# EAGLE schematic 24S Sensor Schematic v9 (EAGLE 9.7.0)
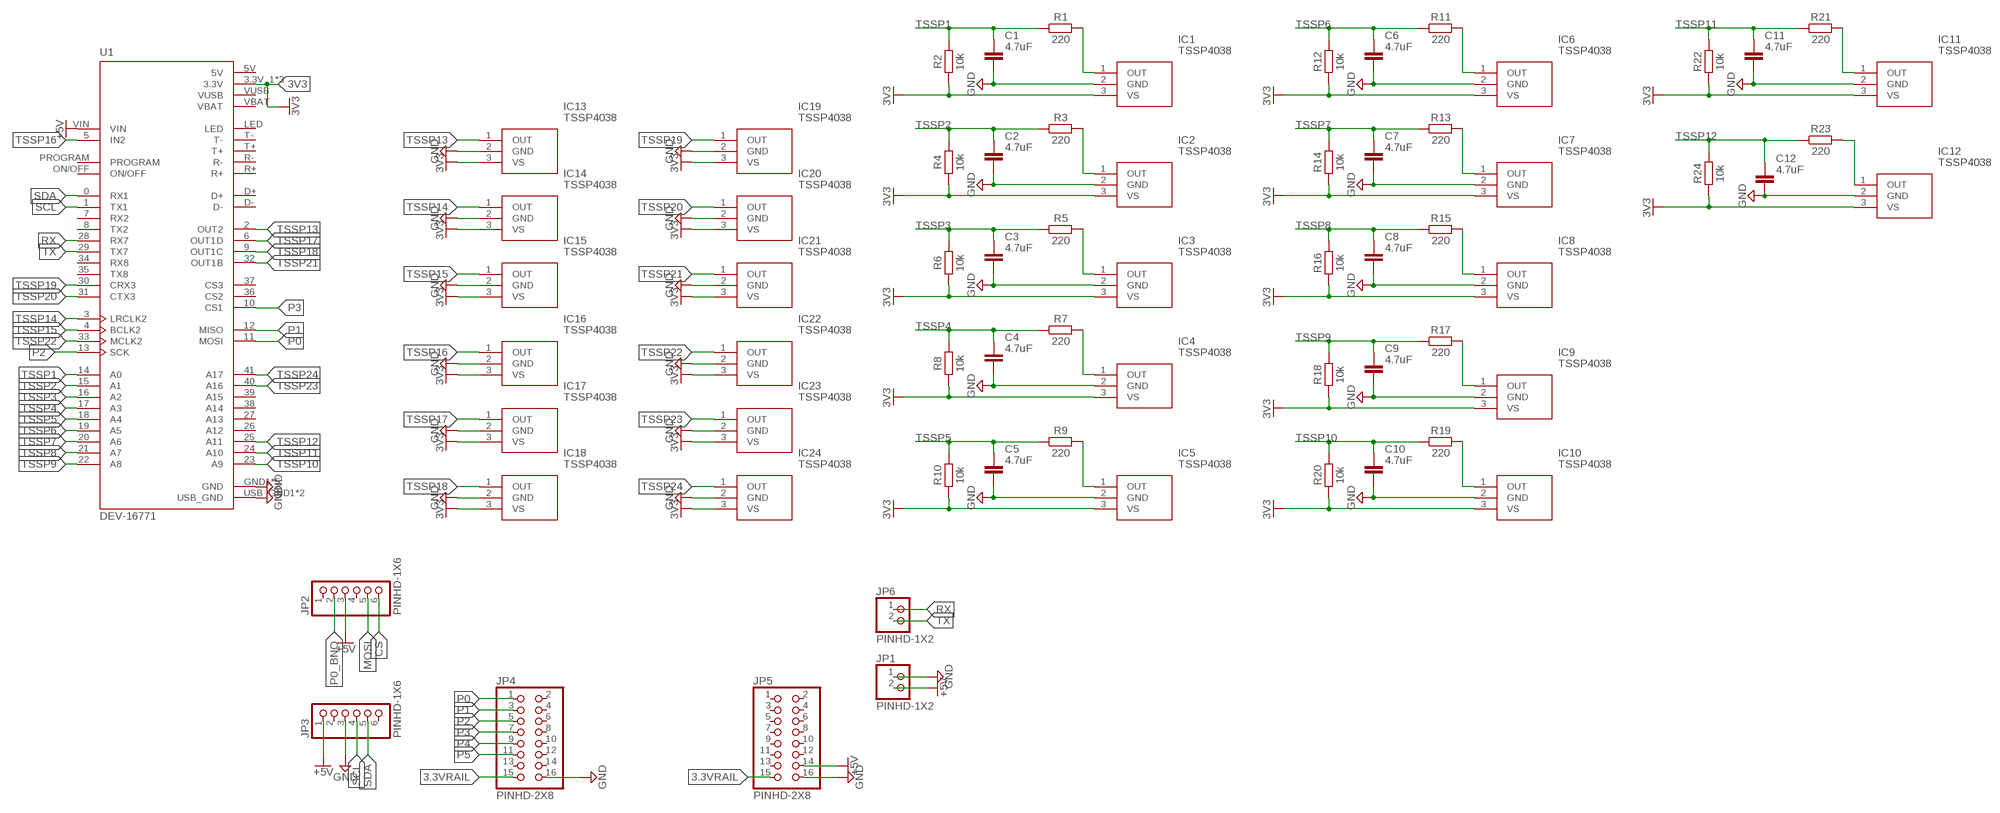
[diagram p0: schematic, sheet 1]

## Parts
C1  4.7uF  C_CHIP-1206(3216-METRIC)  [CAPC3216X135]
C2  4.7uF  C_CHIP-1206(3216-METRIC)  [CAPC3216X135]
C3  4.7uF  C_CHIP-1206(3216-METRIC)  [CAPC3216X135]
C4  4.7uF  C_CHIP-1206(3216-METRIC)  [CAPC3216X135]
C5  4.7uF  C_CHIP-1206(3216-METRIC)  [CAPC3216X135]
C6  4.7uF  C_CHIP-1206(3216-METRIC)  [CAPC3216X135]
C7  4.7uF  C_CHIP-1206(3216-METRIC)  [CAPC3216X135]
C8  4.7uF  C_CHIP-1206(3216-METRIC)  [CAPC3216X135]
C9  4.7uF  C_CHIP-1206(3216-METRIC)  [CAPC3216X135]
C10  4.7uF  C_CHIP-1206(3216-METRIC)  [CAPC3216X135]
C11  4.7uF  C_CHIP-1206(3216-METRIC)  [CAPC3216X135]
C12  4.7uF  C_CHIP-1206(3216-METRIC)  [CAPC3216X135]
IC1  TSSP4038  [TSSP4038]
IC2  TSSP4038  [TSSP4038]
IC3  TSSP4038  [TSSP4038]
IC4  TSSP4038  [TSSP4038]
IC5  TSSP4038  [TSSP4038]
IC6  TSSP4038  [TSSP4038]
IC7  TSSP4038  [TSSP4038]
IC8  TSSP4038  [TSSP4038]
IC9  TSSP4038  [TSSP4038]
IC10  TSSP4038  [TSSP4038]
IC11  TSSP4038  [TSSP4038]
IC12  TSSP4038  [TSSP4038]
IC13  TSSP4038  [TSSP4038]
IC14  TSSP4038  [TSSP4038]
IC15  TSSP4038  [TSSP4038]
IC16  TSSP4038  [TSSP4038]
IC17  TSSP4038  [TSSP4038]
IC18  TSSP4038  [TSSP4038]
IC19  TSSP4038  [TSSP4038]
IC20  TSSP4038  [TSSP4038]
IC21  TSSP4038  [TSSP4038]
IC22  TSSP4038  [TSSP4038]
IC23  TSSP4038  [TSSP4038]
IC24  TSSP4038  [TSSP4038]
JP1  PINHD-1X2  [1X02]
JP2  PINHD-1X6  [1X06]
JP3  PINHD-1X6  [1X06]
JP4  PINHD-2X8  [2X08]
JP5  PINHD-2X8  [2X08]
JP6  PINHD-1X2  [1X02]
R1  220  R_CHIP-1206(3216-METRIC)  [RESC3216X70]
R2  10k  R_CHIP-1206(3216-METRIC)  [RESC3216X70]
R3  220  R_CHIP-1206(3216-METRIC)  [RESC3216X70]
R4  10k  R_CHIP-1206(3216-METRIC)  [RESC3216X70]
R5  220  R_CHIP-1206(3216-METRIC)  [RESC3216X70]
R6  10k  R_CHIP-1206(3216-METRIC)  [RESC3216X70]
R7  220  R_CHIP-1206(3216-METRIC)  [RESC3216X70]
R8  10k  R_CHIP-1206(3216-METRIC)  [RESC3216X70]
R9  220  R_CHIP-1206(3216-METRIC)  [RESC3216X70]
R10  10k  R_CHIP-1206(3216-METRIC)  [RESC3216X70]
R11  220  R_CHIP-1206(3216-METRIC)  [RESC3216X70]
R12  10k  R_CHIP-1206(3216-METRIC)  [RESC3216X70]
R13  220  R_CHIP-1206(3216-METRIC)  [RESC3216X70]
R14  10k  R_CHIP-1206(3216-METRIC)  [RESC3216X70]
R15  220  R_CHIP-1206(3216-METRIC)  [RESC3216X70]
R16  10k  R_CHIP-1206(3216-METRIC)  [RESC3216X70]
R17  220  R_CHIP-1206(3216-METRIC)  [RESC3216X70]
R18  10k  R_CHIP-1206(3216-METRIC)  [RESC3216X70]
R19  220  R_CHIP-1206(3216-METRIC)  [RESC3216X70]
R20  10k  R_CHIP-1206(3216-METRIC)  [RESC3216X70]
R21  220  R_CHIP-1206(3216-METRIC)  [RESC3216X70]
R22  10k  R_CHIP-1206(3216-METRIC)  [RESC3216X70]
R23  220  R_CHIP-1206(3216-METRIC)  [RESC3216X70]
R24  10k  R_CHIP-1206(3216-METRIC)  [RESC3216X70]
U1  DEV-16771  [MODULE_DEV-16771]

## Nets
3.3VRAIL: JP4.15 JP5.15
3V3: IC1.3(VS) IC2.3(VS) IC3.3(VS) IC4.3(VS) IC5.3(VS) IC6.3(VS) IC7.3(VS) IC8.3(VS) IC9.3(VS) IC10.3(VS) IC11.3(VS) IC12.3(VS) IC13.3(VS) IC14.3(VS) IC15.3(VS) IC16.3(VS) IC17.3(VS) IC18.3(VS) IC19.3(VS) IC20.3(VS) IC21.3(VS) IC22.3(VS) IC23.3(VS) IC24.3(VS) R2.1 R4.1 R6.1 R8.1 R10.1 R12.1 R14.1 R16.1 R18.1 R20.1 R22.1 R24.1 U1.3.3V_1(3.3V) U1.3.3V_2(3.3V) U1.3.3V_3(3.3V)
+5V: JP1.2 JP2.3 JP3.1 JP5.14 U1.VIN
CS: JP2.6
GND: C1.2 C2.2 C3.2 C4.2 C5.2 C6.2 C7.2 C8.2 C9.2 C10.2 C11.2 C12.2 IC1.2(GND) IC2.2(GND) IC3.2(GND) IC4.2(GND) IC5.2(GND) IC6.2(GND) IC7.2(GND) IC8.2(GND) IC9.2(GND) IC10.2(GND) IC11.2(GND) IC12.2(GND) IC13.2(GND) IC14.2(GND) IC15.2(GND) IC16.2(GND) IC17.2(GND) IC18.2(GND) IC19.2(GND) IC20.2(GND) IC21.2(GND) IC22.2(GND) IC23.2(GND) IC24.2(GND) JP1.1 JP3.3 JP4.16 JP5.16 U1.GND1(GND) U1.GND2(GND) U1.GND3(GND) U1.GND4(GND) U1.GND5(GND) U1.USB_GND1(USB_GND) U1.USB_GND2(USB_GND)
MOSI: JP2.5
N$1: IC12.1(OUT) R23.2
N$2: IC1.1(OUT) R1.2
N$3: IC2.1(OUT) R3.2
N$5: IC3.1(OUT) R5.2
N$7: IC4.1(OUT) R7.2
N$9: IC5.1(OUT) R9.2
N$11: IC6.1(OUT) R11.2
N$13: IC7.1(OUT) R13.2
N$15: IC8.1(OUT) R15.2
N$17: IC9.1(OUT) R17.2
N$19: IC10.1(OUT) R19.2
N$21: IC11.1(OUT) R21.2
P0: JP4.1 U1.11(MOSI)
P0_BNO: JP2.2
P1: JP4.3 U1.12(MISO)
P2: JP4.5 U1.13(SCK)
P3: JP4.7 U1.10(CS1)
P4: JP4.9
P5: JP4.11
RX: JP6.1 U1.28(RX7)
SCL: JP3.4 U1.1(TX1)
SDA: JP3.5 U1.0(RX1)
TSSP1: C1.1 R1.1 R2.2 U1.14(A0)
TSSP2: C2.1 R3.1 R4.2 U1.15(A1)
TSSP3: C3.1 R5.1 R6.2 U1.16(A2)
TSSP4: C4.1 R7.1 R8.2 U1.17(A3)
TSSP5: C5.1 R9.1 R10.2 U1.18(A4)
TSSP6: C6.1 R11.1 R12.2 U1.19(A5)
TSSP7: C7.1 R13.1 R14.2 U1.20(A6)
TSSP8: C8.1 R15.1 R16.2 U1.21(A7)
TSSP9: C9.1 R17.1 R18.2 U1.22(A8)
TSSP10: C10.1 R19.1 R20.2 U1.23(A9)
TSSP11: C11.1 R21.1 R22.2 U1.24(A10)
TSSP12: C12.1 R23.1 R24.2 U1.25(A11)
TSSP13: IC13.1(OUT) U1.2(OUT2)
TSSP14: IC14.1(OUT) U1.3(LRCLK2)
TSSP15: IC15.1(OUT) U1.4(BCLK2)
TSSP16: IC16.1(OUT) U1.5(IN2)
TSSP17: IC17.1(OUT) U1.6(OUT1D)
TSSP18: IC18.1(OUT) U1.9(OUT1C)
TSSP19: IC19.1(OUT) U1.30(CRX3)
TSSP20: IC20.1(OUT) U1.31(CTX3)
TSSP21: IC21.1(OUT) U1.32(OUT1B)
TSSP22: IC22.1(OUT) U1.33(MCLK2)
TSSP23: IC23.1(OUT) U1.40(A16)
TSSP24: IC24.1(OUT) U1.41(A17)
TX: JP6.2 U1.29(TX7)
Unconnected: JP2.1 JP2.4 JP3.2 JP3.6 JP4.2 JP4.4 JP4.6 JP4.8 JP4.10 JP4.12 JP4.13 JP4.14 JP5.1 JP5.2 JP5.3 JP5.4 JP5.5 JP5.6 JP5.7 JP5.8 JP5.9 JP5.10 JP5.11 JP5.12 JP5.13 U1.7(RX2) U1.8(TX2) U1.26(A12) U1.27(A13) U1.34(RX8) U1.35(TX8) U1.36(CS2) U1.37(CS3) U1.38(A14) U1.39(A15) U1.D+ U1.D- U1.LED U1.ON/OFF U1.PROGRAM U1.R+ U1.R- U1.T+ U1.T- U1.VBAT U1.VUSB

## Power pins joined to a net without a drawn wire
5V: U1.5V

## Library data of the parts
C1-C12 = Tutorial - Fusion 360:C: Capacitor - Generic; CATEGORY: Capacitor
IC1-IC24 = TSSP4038:TSSP4038: IR Receiver Module 38KHz 25m EMI 3-Pin Vishay TSSP4038, 38kHz IR Receiver, 950nm +/-45 , 25m Range, 2.5V - 5V, Through Hole, 6 x 3.9 x 6.95mm Source: Datasheet <https://componentsearchengine.com/Datasheets/2/TSSP4038.pdf>; DESCRIPTION: IR Receiver Module 38KHz 25m EMI 3-Pin Vishay TSSP4038, 38kHz IR Receiver, 950nm +/-45 , 25m Range, 2.5V - 5V, Through Hole, 6 x 3.9 x 6.95mm; HEIGHT: mm; MANUFACTURER_NAME: Vishay; MANUFACTURER_PART_NUMBER: TSSP4038; MOUSER_PART_NUMBER: 782-TSSP4038; MOUSER_PRICE-STOCK: https://www.mouser.co.uk/ProductDetail/Vishay-Semiconductors/TSSP4038?qs=lgjwDzixuo3Ja5hn%252BEmOdw%3D%3D
JP1 JP6 = Connector:PINHD-1X2: PIN HEADER; CATEGORY: Headers; DESCRIPTION: Header, Straight, 2 Position; MANUFACTURER: Generic; MPN: Generic; OPERATING_TEMPERATURE: Generic; PART_STATUS: Active; PITCH: 0.100" (2.54mm); ROHS_COMPLIANCE: Generic; SERIES: Generic; SUB-CATEGORY: Headers, Male Pins; TYPE: Board to Board or Cable, Unshrouded, Through Hole, Straight
JP2 JP3 = Connector:PINHD-1X6: PIN HEADER; CATEGORY: Headers; DESCRIPTION: Header, Straight, 6 Position; MANUFACTURER: Generic; MPN: Generic; OPERATING_TEMPERATURE: Generic; PART_STATUS: Active; PITCH: 0.100" (2.54mm); ROHS_COMPLIANCE: Generic; SERIES: Generic; SUB-CATEGORY: Headers, Male Pins; TYPE: Board to Board or Cable, Unshrouded, Through Hole, Straight
JP4 JP5 = Connector:PINHD-2X8: PIN HEADER; CATEGORY: Headers; DESCRIPTION: Header, Straight, 2x8 Position; MANUFACTURER: Generic; MPN: Generic; OPERATING_TEMPERATURE: Generic; PART_STATUS: Active; PITCH: 0.100" (2.54mm); ROHS_COMPLIANCE: Generic; SERIES: Generic; SUB-CATEGORY: Headers, Male Pins; TYPE: Board to Board or Cable, Unshrouded, Through Hole, Straight
R1-R24 = Resistor:R: Resistor Fixed - Generic; CATEGORY: Resistor; SUB-CATEGORY: Fixed
U1 = DEV-16771:DEV-16771: RT1062 Teensy 4.1 i.MX ARM Cortex-M7 MPU Embedded Evaluation Board Check availability <https://pricing.snapeda.com/parts/DEV-16771/SparkFun%20Electronics/view-part?ref=eda>; AVAILABILITY: In Stock; CHECK_PRICES: https://www.snapeda.com/parts/DEV-16771/SparkFun+Electronics/view-part/?ref=eda; DESCRIPTION: RT1062 Teensy 4.1 series ARM® Cortex®-M7 MPU Embedded Evaluation Board; MF: SparkFun Electronics; MP: DEV-16771; PACKAGE: None; PRICE: None; PURCHASE-URL: https://www.snapeda.com/api/url_track_click_mouser/?unipart_id=4833875&manufacturer=SparkFun Electronics&part_name=DEV-16771&search_term=None; SNAPEDA_LINK: https://www.snapeda.com/parts/DEV-16771/SparkFun+Electronics/view-part/?ref=snap